# Altium schematic sheet Communication.SchDoc
size A4; SheetNumber: 7; SheetTotal: 10
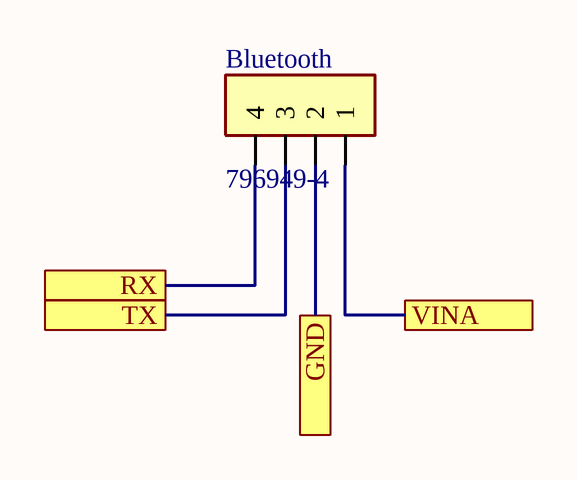
[diagram p0: Communication.SchDoc]

## Parts
Bluetooth  796949-4  [TE_796949-4]

## Ports
GND (see GlobalcircuitSchDoc[3B]), RX (see GlobalcircuitSchDoc[3C], Microcontroller[2B]), TX (see GlobalcircuitSchDoc[3B], Microcontroller[2B]), VINA (see GlobalcircuitSchDoc[3B], InputSockets[2B], Microcontroller[3C], Probe_Switches[2B], Probe_Switches[2C], Source_and_regulation[3B])

## Nets
GND: Bluetooth.2 ; port GND
RX: Bluetooth.4 ; port RX
TX: Bluetooth.3 ; port TX
VINA: Bluetooth.1 ; port VINA

## Library data of the parts
Bluetooth = 796949-4: 4 Position Wire to Board Terminal Block Horizontal with Board 0.200 _5.08mm_ Through Hole; MF: TE Connectivity; Package: None; Value: *; Availability: Unavailable; SnapEDA_Link: https://www.snapeda.com/parts/796949-4/TE%20Connectivity%20AMP%20Connectors/view-part/492887/?ref=snap; Price: None; MP: 796949-4; TE_purchase_URL: https://www.te.com/usa-en/product-796949-4.html?te_bu=Cor&te_type=disp&te_campaign=seda_glo_cor-seda-global-disp-prtnr-fy19-seda-model-bom-cta_sma-317_1&elqCampaignId=32493; EU_RoHS_Compliance: Compliant with Exemptions